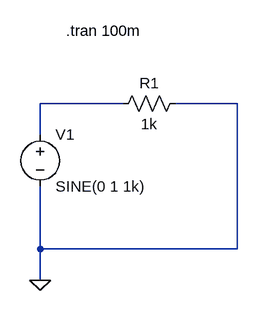
[diagram p0: schematic Draft3.asc]
Draft3.asc, the LTspice schematic file:
Version 4
SHEET 1 880 680
WIRE 160 192 32 192
WIRE 336 192 240 192
WIRE 32 240 32 192
WIRE 32 416 32 320
WIRE 336 416 336 192
WIRE 336 416 32 416
WIRE 32 464 32 416
FLAG 32 464 0
SYMBOL voltage 32 224 R0
SYMATTR InstName V1
SYMATTR Value SINE(0 1 1k)
SYMBOL res 256 176 R90
WINDOW 0 0 56 VBottom 2
WINDOW 3 32 56 VTop 2
SYMATTR InstName R1
SYMATTR Value 1k
TEXT 72 80 Left 2 !.tran 100m

The netlist it stands for:
* Draft3.asc
V1 N001 0 SINE(0 1 1k)
R1 0 N001 1k
.tran 100m
.backanno
.end